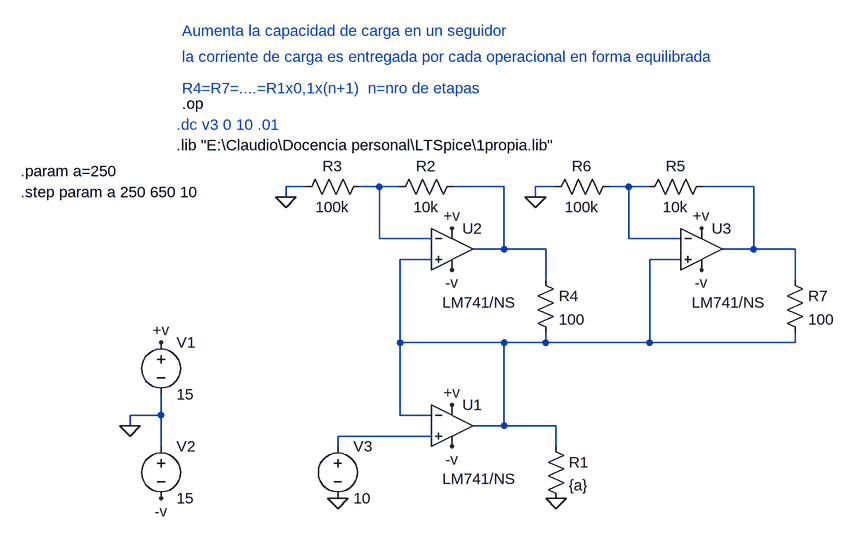
[diagram p0: schematic oper_carga2.asc]
oper_carga2.asc, the LTspice schematic file:
Version 4
SHEET 1 2340 680
WIRE 32 -96 0 -96
WIRE 144 -96 112 -96
WIRE 176 -96 144 -96
WIRE 336 -96 256 -96
WIRE 416 -96 384 -96
WIRE 528 -96 496 -96
WIRE 560 -96 528 -96
WIRE 720 -96 640 -96
WIRE 0 -80 0 -96
WIRE 384 -80 384 -96
WIRE 144 -16 144 -96
WIRE 224 -16 144 -16
WIRE 528 -16 528 -96
WIRE 608 -16 528 -16
WIRE 336 0 336 -96
WIRE 336 0 288 0
WIRE 400 0 336 0
WIRE 720 0 720 -96
WIRE 720 0 672 0
WIRE 784 0 720 0
WIRE 224 16 176 16
WIRE 608 16 560 16
WIRE 400 48 400 0
WIRE 784 48 784 0
WIRE 176 144 176 16
WIRE 336 144 176 144
WIRE 400 144 400 128
WIRE 400 144 336 144
WIRE 560 144 560 16
WIRE 560 144 400 144
WIRE 784 144 784 128
WIRE 784 144 560 144
WIRE -192 256 -192 224
WIRE -192 256 -240 256
WIRE 176 256 176 144
WIRE 224 256 176 256
WIRE -240 272 -240 256
WIRE 336 272 336 144
WIRE 336 272 288 272
WIRE 416 272 336 272
WIRE 224 288 80 288
WIRE -192 304 -192 256
WIRE 80 304 80 288
WIRE 416 304 416 272
FLAG -240 272 0
FLAG -192 144 +v
FLAG 256 240 +v
FLAG -192 384 -v
FLAG 256 304 -v
FLAG 80 384 0
FLAG 416 384 0
FLAG 256 -32 +v
FLAG 256 32 -v
FLAG 0 -80 0
FLAG 640 -32 +v
FLAG 640 32 -v
FLAG 384 -80 0
DATAFLAG 480 144 ""
DATAFLAG 368 0 ""
DATAFLAG 752 0 ""
DATAFLAG 416 272 ""
DATAFLAG 176 160 ""
SYMBOL OpAmps\\opamp2 256 208 R0
WINDOW 3 -15 146 Left 2
SYMATTR Value LM741/NS
SYMATTR InstName U1
SYMBOL voltage -192 128 R0
WINDOW 123 0 0 Left 0
WINDOW 39 0 0 Left 0
SYMATTR InstName V1
SYMATTR Value 15
SYMBOL voltage -192 288 R0
WINDOW 123 0 0 Left 0
WINDOW 39 0 0 Left 0
SYMATTR InstName V2
SYMATTR Value 15
SYMBOL voltage 80 288 R0
WINDOW 123 0 0 Left 0
WINDOW 39 0 0 Left 0
SYMATTR InstName V3
SYMATTR Value 10
SYMBOL res 400 288 R0
SYMATTR InstName R1
SYMATTR Value {a}
SYMBOL OpAmps\\opamp2 256 -64 R0
WINDOW 3 -15 146 Left 2
SYMATTR Value LM741/NS
SYMATTR InstName U2
SYMBOL res 272 -112 R90
WINDOW 0 0 56 VBottom 2
WINDOW 3 32 56 VTop 2
SYMATTR InstName R2
SYMATTR Value 10k
SYMBOL res 128 -112 R90
WINDOW 0 0 56 VBottom 2
WINDOW 3 32 56 VTop 2
SYMATTR InstName R3
SYMATTR Value 100k
SYMBOL res 384 32 R0
SYMATTR InstName R4
SYMATTR Value 100
SYMBOL OpAmps\\opamp2 640 -64 R0
WINDOW 3 -15 146 Left 2
SYMATTR Value LM741/NS
SYMATTR InstName U3
SYMBOL res 656 -112 R90
WINDOW 0 0 56 VBottom 2
WINDOW 3 32 56 VTop 2
SYMATTR InstName R5
SYMATTR Value 10k
SYMBOL res 512 -112 R90
WINDOW 0 0 56 VBottom 2
WINDOW 3 32 56 VTop 2
SYMATTR InstName R6
SYMATTR Value 100k
SYMBOL res 768 32 R0
SYMATTR InstName R7
SYMATTR Value 100
TEXT -168 -160 Left 2 !.lib "E:\\Claudio\\Docencia personal\\LTSpice\\1propia.lib"
TEXT -168 -192 Left 2 ;.dc v3 0 10 .01
TEXT -160 -248 Left 2 ;R4=R7=....=R1x0,1x(n+1)  n=nro de etapas
TEXT -160 -336 Left 2 ;Aumenta la capacidad de carga en un seguidor
TEXT -160 -224 Left 2 !.op
TEXT -160 -296 Left 2 ;la corriente de carga es entregada por cada operacional en forma equilibrada
TEXT -408 -120 Left 2 !.param a=250
TEXT -408 -88 Left 2 !.step param a 250 650 10

The netlist it stands for:
* oper_carga2.asc
XU1 N006 N005 +v -v N005 LM741/NS  ; pins In+ In- V+ V- OUT
V1 +v 0 15
V2 0 -v 15
V3 N006 0 10
R1 N005 0 {a}
XU2 N005 N001 +v -v N002 LM741/NS  ; pins In+ In- V+ V- OUT
R2 N002 N001 10k
R3 N001 0 100k
R4 N002 N005 100
XU3 N005 N003 +v -v N004 LM741/NS  ; pins In+ In- V+ V- OUT
R5 N004 N003 10k
R6 N003 0 100k
R7 N004 N005 100
.lib "E:\Claudio\Docencia personal\LTSpice\1propia.lib"
* .dc v3 0 10 .01
* R4=R7=....=R1x0,1x(n+1)  n=nro de etapas
* Aumenta la capacidad de carga en un seguidor
.op
* la corriente de carga es entregada por cada operacional en forma equilibrada
.param a=250
.step param a 250 650 10
.backanno
.end